# Altium schematic sheet Relay.SchDoc
size A
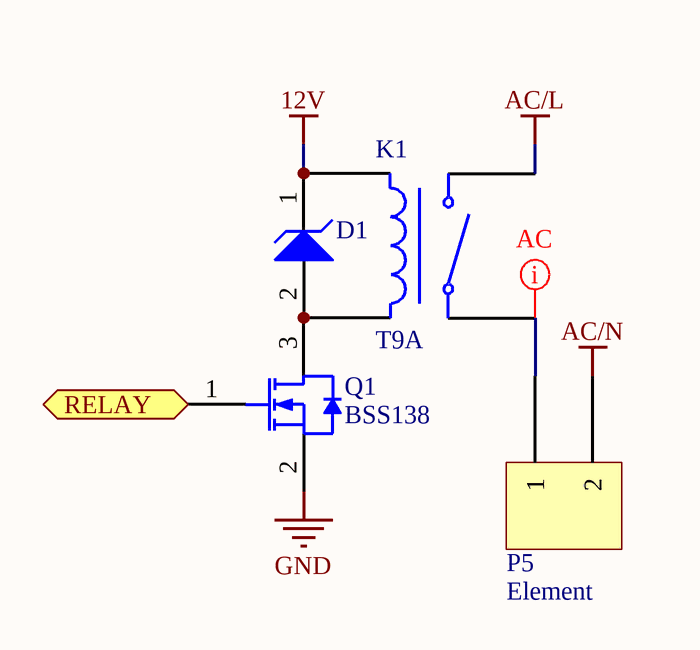
[diagram p0: Relay.SchDoc]

## Parts
D1  SMF18AT1G  [ONSC-SOD-123FL-2-498_V]  (value not drawn)
K1  T9A  [PCBComponent_1 - duplicate]
P5  Element  [PCBComponent_1]
Q1  BSS138  [FAIR-SOT23-3_V]

## Ports
RELAY (in)

## Nets
12V: D1.1(K) K1.COIL_B
AC/L: K1.LOAD
AC/N: P5.2
GND: Q1.2(S)
RELAY: Q1.1(G) ; port RELAY
NetD1_2: D1.2(A) K1.COIL_A Q1.3(D)
NetK1_COM: K1.COM P5.1

## Layout directives
net class AC: NetK1_COM

## Library data of the parts
D1 = CMP-1061-00605-1: 200 W Transient Voltage Suppressor, 2-Pin SOD-123FL, Pb-Free, Tape and Reel; Manufacturer: On Semiconductor; Direction: Unidirectional; IR Max (uA): 1; V(BR) Typ (V): 21; ComponentLink3Description: Package Specification; ComponentLink1URL: http://www.onsemi.com/; PartNumber: SMF18AT1G; ComponentLink3URL: http://www.onsemi.com/pub_link/Collateral/498-01.PDF; PackageDescription: 2-Pin SOD, Body 1.65 x 2.7 mm; Mounting Technology: Surface Mount; ComponentLink1Description: Manufacturer URL; DatasheetVersion: Rev. 7; ComponentLink2URL: http://www.onsemi.com/pub_link/Collateral/SMF5.0AT1-D.PDF; ComponentLink2Description: Datasheet; PackageVersion: Rev. D, 05/2013; PackageReference: SOD-123FL-2-498; Packing: Tape and Reel; RoHS: Pb-Free
P5 = EUROSTYLE 6 35 MM FIXED 2 CIR
Q1 = CMP-1670-00009-1: N-Channel Logic Level Enhancement Mode Field Effect Transistor, 220 mA, 50 V, -55 to 150 degC, 3-Pin SOT-23, RoHS, Tape and Reel; ESR: 40 Ohm; Tolerance: 30ppm; Capacitance: 1.8E-11 f; Load Capacitance: 18 pF; Frequency: 12 MHz; Resistance: 100 Ohm; Min Operating Temperature: -20degC; ComponentLink2URL: https://www.fairchildsemi.com/datasheets/BS/BSS138.pdf; Max Operating Temperature: 70degC; Width: 0.126 inch; Pins: 4; Length: 0.197 inch; ComponentLink2Description: Datasheet; Package Quantity: 1; PackageReference: SOT23-3; Packaging: Tape and Reel; RoHSCompliant: True; Frequency Tolerance: 30ppm; ComponentLink3Description: Package Specification; Mount: Surface Mount; REACH SVHC: Unknown; Height: 0.041 inch; ComponentLink1URL: https://www.fairchildsemi.com/; PackageDescription: 3-Pin Small Outline Transistor, Body 2.92 x 1.325 mm, Pitch 0.95 mm; ComponentLink3URL: http://www.fairchildsemi.com/dwg/MA/MA03D.pdf; ComponentLink1Description: Manufacturer URL; DatasheetVersion: Rev. C, 10/2005